# EAGLE schematic CAR schematic design (EAGLE 9.0.0)
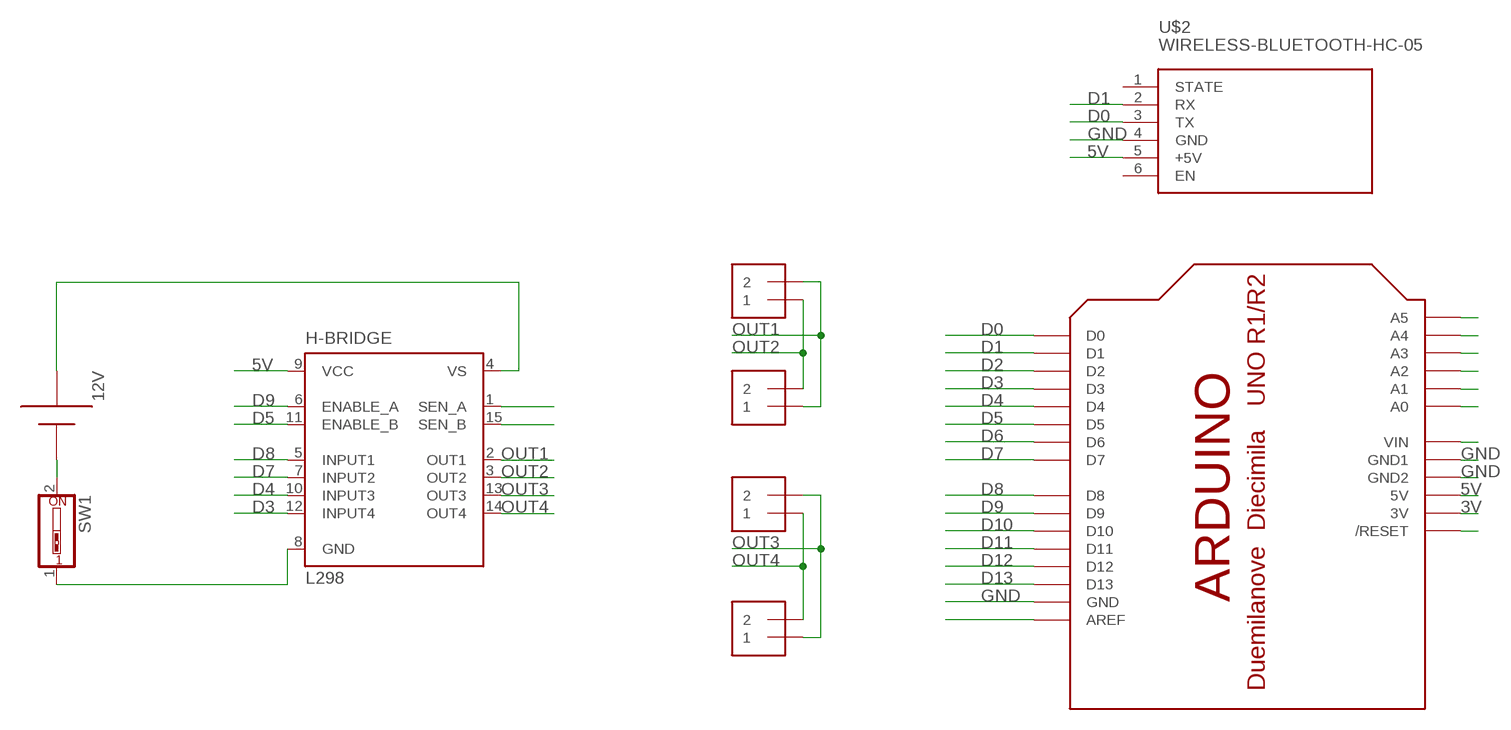
[diagram p0: schematic, sheet 1]

## Parts
12V  AAA  [12BH412]
H-BRIDGE  L298  [MULTIWATT-15]
MOTOA1  1X2-3.5MM  [1X2-3.5MM]
MOTORA2  1X2-3.5MM  [1X2-3.5MM]
MOTORB1  1X2-3.5MM  [1X2-3.5MM]
MOTORB2  1X2-3.5MM  [1X2-3.5MM]
SW1  SW_DIP-1  [EDG-01]
U$1  ARDUINO-NOHOLE  [ARDUINO-NOHOLE]
U$2  WIRELESS-BLUETOOTH-HC-05  [WIRELESS-BLUETOOTH-HC-05]

## Nets
3V: U$1.3V
5V: H-BRIDGE.9(VCC) U$1.5V U$2.5(+5V)
A0: U$1.A0
A1: U$1.A1
A2: U$1.A2
A3: U$1.A3
A4: U$1.A4
A5: U$1.A5
AREF: U$1.AREF
D0: U$1.D0 U$2.3(TX)
D1: U$1.D1 U$2.2(RX)
D2: U$1.D2
D3: H-BRIDGE.12(INPUT4) U$1.D3
D4: H-BRIDGE.10(INPUT3) U$1.D4
D5: H-BRIDGE.11(ENABLE_B) U$1.D5
D6: U$1.D6
D7: H-BRIDGE.7(INPUT2) U$1.D7
D8: H-BRIDGE.5(INPUT1) U$1.D8
D9: H-BRIDGE.6(ENABLE_A) U$1.D9
D10: U$1.D10
D11: U$1.D11
D12: U$1.D12
D13: U$1.D13
GND: U$1.GND U$1.GND1 U$1.GND2 U$2.4(GND)
N$1: H-BRIDGE.8(GND) SW1.1
N$2: 12V.- H-BRIDGE.4(VS)
N$10: H-BRIDGE.1(SEN_A)
N$11: H-BRIDGE.15(SEN_B)
N$29: 12V.+ SW1.2
OUT1: H-BRIDGE.2(OUT1) MOTOA1.2 MOTORA2.1
OUT2: H-BRIDGE.3(OUT2) MOTOA1.1 MOTORA2.2
OUT3: H-BRIDGE.13(OUT3) MOTORB1.2 MOTORB2.1
OUT4: H-BRIDGE.14(OUT4) MOTORB1.1 MOTORB2.2
RESET: U$1.RESET(/RESET)
VIN: U$1.VIN
Unconnected: U$2.1(STATE) U$2.6(EN)

## Library data of the parts
12V = adafruit:AAA: AAA PC pin holder Mouser part #12BH412 - but pretty much any 1x AAA battery holder should be the same http://www.ladyada.net/library/pcb/eaglelibrary.html
H-BRIDGE = st-microelectronics:L298: DUAL FULL-BRIDGE DRIVER; MPN: L298N; OC_FARNELL: 1589425; OC_NEWARK: 32M1527
MOTOA1 MOTORA2 MOTORB1 MOTORB2 = adafruit:1X2: 3.5mm Terminal block http://www.ladyada.net/library/pcb/eaglelibrary.html
SW1 = special:SW_DIP-1: DIP SWITCH
U$1 = adafruit:ARDUINO: Arduino Diecimila/Duemilanove Make a shield with ease, this package has all the named pins as well as the two mounting drill holes and an outline of the USB and DC power connector. The outline is on the DIMENSION layer, so if your board house uses it they will cut the outline to match. http://www.ladyada.net/library/pcb/eaglelibrary.html
U$2 = diy-modules:WIRELESS-BLUETOOTH-HC-05: Bluetooth Transceiver Module based on HC-05 board Tutorial is available here: https://arduino-info.wikispaces.com/BlueTooth-HC05-HC06-Modules-How-To Click here to find device on ebay.com <http://www.ebay.com/sch/hc-05+module+rs232>